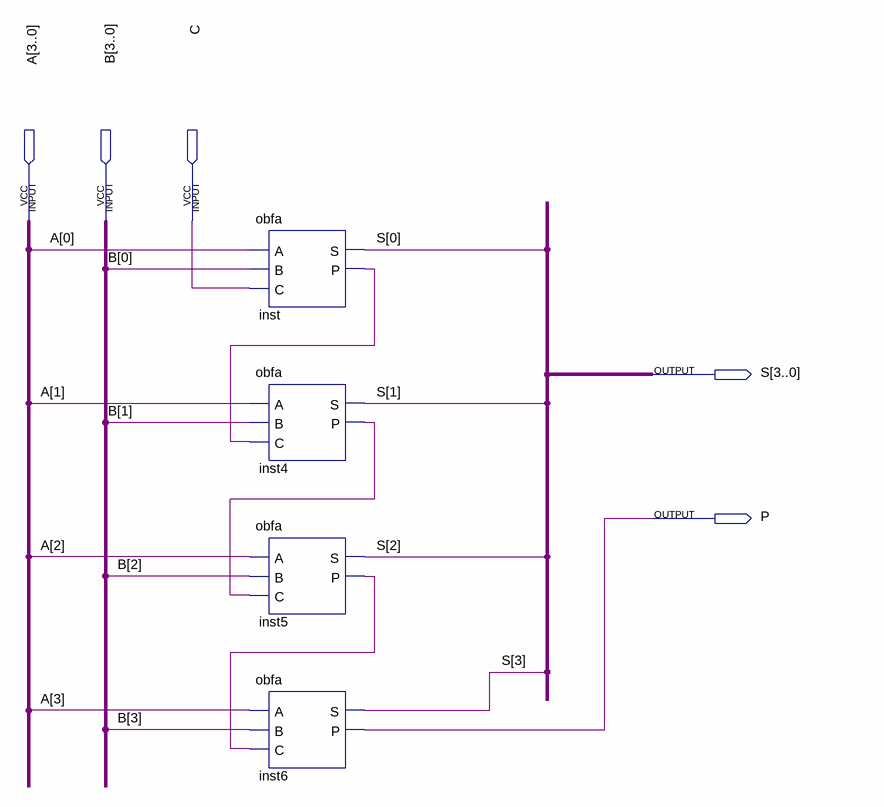
[diagram p0: schematic sheet]
// Quartus schematic parallel_4b_adder.bdf as structural Verilog: 4 symbols, 5 pins
module parallel_4b_adder (
  input  [3:0] A,
  input  [3:0] B,
  input  C,
  output [3:0] S,
  output P
);

  wire inst4_p, inst5_p, inst_p;

  obfa inst (.A(A[0]), .B(B[0]), .C(C), .S(S[0]), .P(inst_p));
  obfa inst4 (.A(A[1]), .B(B[1]), .C(inst_p), .S(S[1]), .P(inst4_p));
  obfa inst5 (.A(A[2]), .B(B[2]), .C(inst4_p), .S(S[2]), .P(inst5_p));
  obfa inst6 (.A(A[3]), .B(B[3]), .C(inst5_p), .S(S[3]), .P(P));
endmodule
